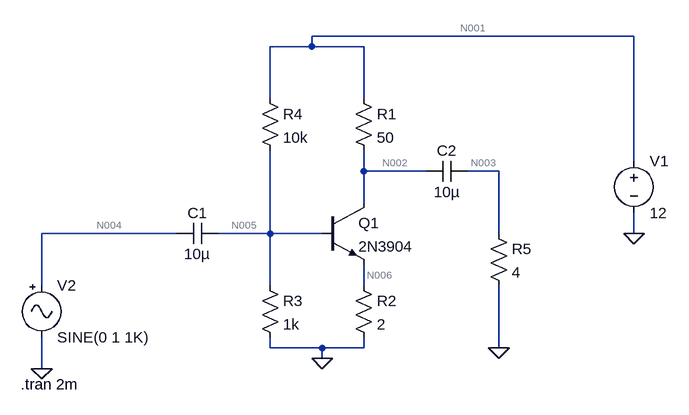
[diagram p0: schematic Headphone amplifier.asc]
Headphone amplifier.asc, the LTspice schematic file:
Version 4
SHEET 1 880 680
WIRE 640 -160 144 -160
WIRE 144 -144 144 -160
WIRE 144 -144 80 -144
WIRE 224 -144 144 -144
WIRE 80 -64 80 -144
WIRE 224 -64 224 -144
WIRE 640 32 640 -160
WIRE 224 48 224 16
WIRE 320 48 224 48
WIRE 432 48 384 48
WIRE 224 96 224 48
WIRE -64 144 -272 144
WIRE 80 144 80 16
WIRE 80 144 0 144
WIRE 160 144 80 144
WIRE 432 144 432 48
WIRE 640 144 640 112
WIRE -272 224 -272 144
WIRE 80 224 80 144
WIRE 224 224 224 192
WIRE 80 320 80 304
WIRE 160 320 80 320
WIRE 224 320 224 304
WIRE 224 320 160 320
WIRE 432 320 432 224
WIRE 160 336 160 320
WIRE -272 352 -272 304
FLAG 160 336 0
FLAG 640 144 0
FLAG -272 352 0
FLAG 432 320 0
SYMBOL npn 160 96 R0
SYMATTR InstName Q1
SYMATTR Value 2N3904
SYMBOL res 208 -80 R0
SYMATTR InstName R1
SYMATTR Value 50
SYMBOL res 208 208 R0
SYMATTR InstName R2
SYMATTR Value 2
SYMBOL res 64 208 R0
SYMATTR InstName R3
SYMATTR Value 1k
SYMBOL res 64 -80 R0
SYMATTR InstName R4
SYMATTR Value 10k
SYMBOL cap 0 128 R90
WINDOW 0 0 32 VBottom 2
WINDOW 3 32 32 VTop 2
SYMATTR InstName C1
SYMATTR Value 10µ
SYMBOL voltage 640 16 R0
WINDOW 123 0 0 Left 0
WINDOW 39 0 0 Left 0
SYMATTR InstName V1
SYMATTR Value 12
SYMBOL Misc\\signal -272 208 R0
SYMATTR InstName V2
SYMBOL cap 384 32 R90
WINDOW 0 0 32 VBottom 2
WINDOW 3 32 32 VTop 2
SYMATTR InstName C2
SYMATTR Value 10µ
SYMBOL res 416 128 R0
SYMATTR InstName R5
SYMATTR Value 4
TEXT -304 376 Left 2 !.tran 2m

The netlist it stands for:
* Headphone amplifier.asc
Q1 N002 N005 N006 0 2N3904
R1 N001 N002 50
R2 N006 0 2
R3 N005 0 1k
R4 N001 N005 10k
C1 N005 N004 10µ
V1 N001 0 12
V2 N004 0 SINE(0 1 1K)
C2 N003 N002 10µ
R5 N003 0 4
.model NPN NPN
.model PNP PNP
.lib standard.bjt
.tran 2m
.backanno
.end

* Results of the author's LTspice run, read from the files saved beside the schematic
* Operating Point, zero values left out:
*   V(n002) = 8.95 V
*   V(n005) = 895.7 mV
*   V(n006) = 122.4 mV
*   V(n001) = 12 V
*   Ic(Q1) = 61 mA
*   Ib(Q1) = 214.7 µA
*   Ie(Q1) = -61.21 mA
*   I(R1) = 61 mA
*   I(R2) = 61.21 mA
*   I(R3) = 895.7 µA
*   I(R4) = 1.11 mA
*   I(V1) = -62.11 mA
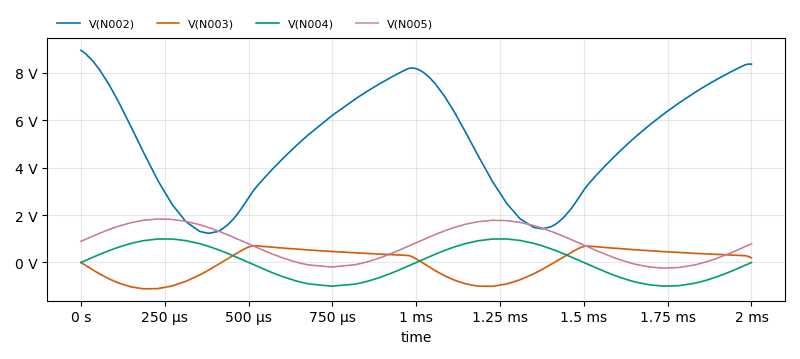
[diagram p1: Transient Analysis of Headphone amplifier.asc, plotted from the saved traces]
* Transient Analysis, 1 run:
*   V(N002): min 1.229 V, max 8.95 V, average 5.036 V, rms 5.547 V, last 8.365 V
*   V(N003): min -1.11 V, max 705.1 mV, average -13.6 mV, rms 607 mV, last 196 mV
*   V(N004): min -999.7 mV, max 992 mV, average 331.7 µV, rms 704.2 mV, last 0 V
*   V(N005): min -237.2 mV, max 1.837 V, average 798.6 mV, rms 1.073 V, last 788 mV